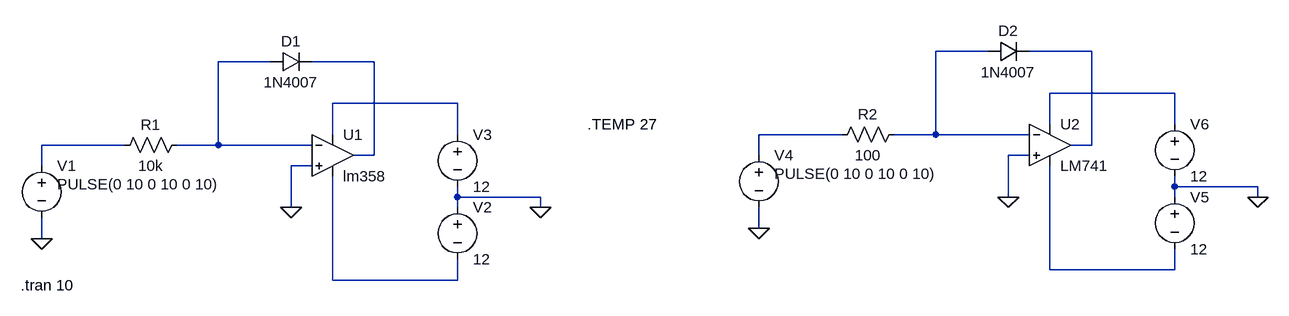
[diagram p0: schematic LogDiode.asc]
LogDiode.asc, the LTspice schematic file:
Version 4
SHEET 1 1636 680
WIRE 1200 -192 1120 -192
WIRE 1360 -192 1264 -192
WIRE 96 -176 16 -176
WIRE 256 -176 160 -176
WIRE 1488 -128 1296 -128
WIRE 384 -112 192 -112
WIRE 1296 -80 1296 -128
WIRE 1488 -80 1488 -128
WIRE 192 -64 192 -112
WIRE 384 -64 384 -112
WIRE 976 -64 848 -64
WIRE 1120 -64 1120 -192
WIRE 1120 -64 1056 -64
WIRE 1264 -64 1120 -64
WIRE -128 -48 -256 -48
WIRE 16 -48 16 -176
WIRE 16 -48 -48 -48
WIRE 160 -48 16 -48
WIRE 1360 -48 1360 -192
WIRE 1360 -48 1328 -48
WIRE 256 -32 256 -176
WIRE 256 -32 224 -32
WIRE 848 -32 848 -64
WIRE 1264 -32 1232 -32
WIRE -256 -16 -256 -48
WIRE 160 -16 128 -16
WIRE 1488 16 1488 0
WIRE 1616 16 1488 16
WIRE 384 32 384 16
WIRE 512 32 384 32
WIRE 1232 32 1232 -32
WIRE 1488 32 1488 16
WIRE 1616 32 1616 16
WIRE 128 48 128 -16
WIRE 384 48 384 32
WIRE 512 48 512 32
WIRE 848 80 848 48
WIRE -256 96 -256 64
WIRE 1296 144 1296 -16
WIRE 1488 144 1488 112
WIRE 1488 144 1296 144
WIRE 192 160 192 0
WIRE 384 160 384 128
WIRE 384 160 192 160
FLAG -256 96 0
FLAG 512 48 0
FLAG 128 48 0
FLAG 848 80 0
FLAG 1616 32 0
FLAG 1232 32 0
SYMBOL voltage -256 -32 R0
WINDOW 3 24 44 Left 2
WINDOW 123 0 0 Left 0
WINDOW 39 0 0 Left 0
SYMATTR Value PULSE(0 10 0 10 0 10)
SYMATTR InstName V1
SYMBOL voltage 384 32 R0
WINDOW 123 0 0 Left 0
WINDOW 39 0 0 Left 0
SYMATTR InstName V2
SYMATTR Value 12
SYMBOL voltage 384 -80 R0
WINDOW 123 0 0 Left 0
WINDOW 39 0 0 Left 0
SYMATTR InstName V3
SYMATTR Value 12
SYMBOL res -32 -64 R90
WINDOW 0 0 56 VBottom 2
WINDOW 3 32 56 VTop 2
SYMATTR InstName R1
SYMATTR Value 10k
SYMBOL diode 96 -160 R270
WINDOW 0 32 32 VTop 2
WINDOW 3 0 32 VBottom 2
SYMATTR InstName D1
SYMATTR Value 1N4007
SYMBOL OpAmps\\lm358 192 -96 R0
SYMATTR InstName U1
SYMBOL voltage 848 -48 R0
WINDOW 3 24 44 Left 2
WINDOW 123 0 0 Left 0
WINDOW 39 0 0 Left 0
SYMATTR Value PULSE(0 10 0 10 0 10)
SYMATTR InstName V4
SYMBOL voltage 1488 16 R0
WINDOW 123 0 0 Left 0
WINDOW 39 0 0 Left 0
SYMATTR InstName V5
SYMATTR Value 12
SYMBOL voltage 1488 -96 R0
WINDOW 123 0 0 Left 0
WINDOW 39 0 0 Left 0
SYMATTR InstName V6
SYMATTR Value 12
SYMBOL res 1072 -80 R90
WINDOW 0 0 56 VBottom 2
WINDOW 3 32 56 VTop 2
SYMATTR InstName R2
SYMATTR Value 100
SYMBOL diode 1200 -176 R270
WINDOW 0 32 32 VTop 2
WINDOW 3 0 32 VBottom 2
SYMATTR InstName D2
SYMATTR Value 1N4007
SYMBOL OpAmps\\LM741 1296 -112 R0
SYMATTR InstName U2
TEXT -288 168 Left 2 !.tran 10
TEXT 584 -80 Left 2 !.TEMP 27

The netlist it stands for:
* LogDiode.asc
V1 N008 0 PULSE(0 10 0 10 0 10)
V2 0 N010 12
V3 N006 0 12
R1 N003 N008 10k
D1 N003 N004 1N4007
XU1 0 N003 N006 N010 N004 lm358  ; pins In+ In- V+ V- OUT
V4 N007 0 PULSE(0 10 0 10 0 10)
V5 0 N009 12
V6 N005 0 12
R2 N001 N007 100
D2 N001 N002 1N4007
XU2 0 N001 N005 N009 N002 LM741  ; pins In+ In- V+ V- OUT
.model D D
.lib standard.dio
.tran 10
.TEMP 27
.lib LM741.lib
.backanno
.end